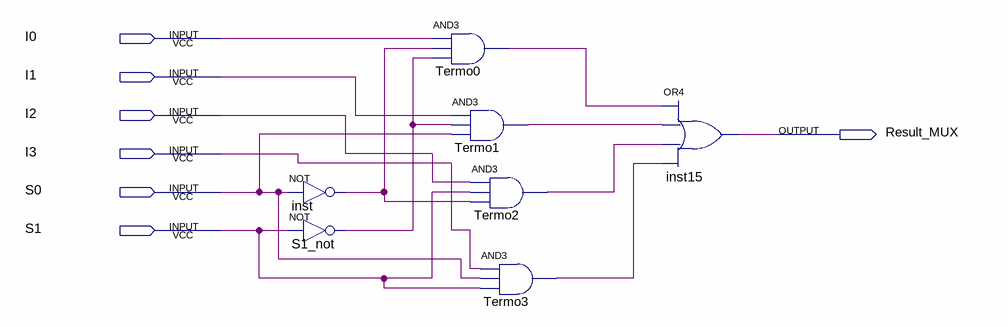
[diagram p0: schematic sheet]
// Quartus schematic MUX.bdf as structural Verilog: 7 symbols, 7 pins
module MUX (
  input  I0,
  input  I1,
  input  I2,
  input  I3,
  input  S0,
  input  S1,
  output Result_MUX
);

  wire inst_out, S1_not_out, Termo0_out, Termo1_out, Termo2_out, Termo3_out;

  not inst (inst_out, S0);
  not S1_not (S1_not_out, S1);
  and Termo0 (Termo0_out, I0, inst_out, S1_not_out);
  and Termo1 (Termo1_out, I1, S1_not_out, S0);
  and Termo2 (Termo2_out, I2, S1, inst_out);
  and Termo3 (Termo3_out, I3, S0, S1);
  or inst15 (Result_MUX, Termo0_out, Termo1_out, Termo2_out, Termo3_out);
endmodule
